# EAGLE design VC02 (EAGLE 7.3.0)
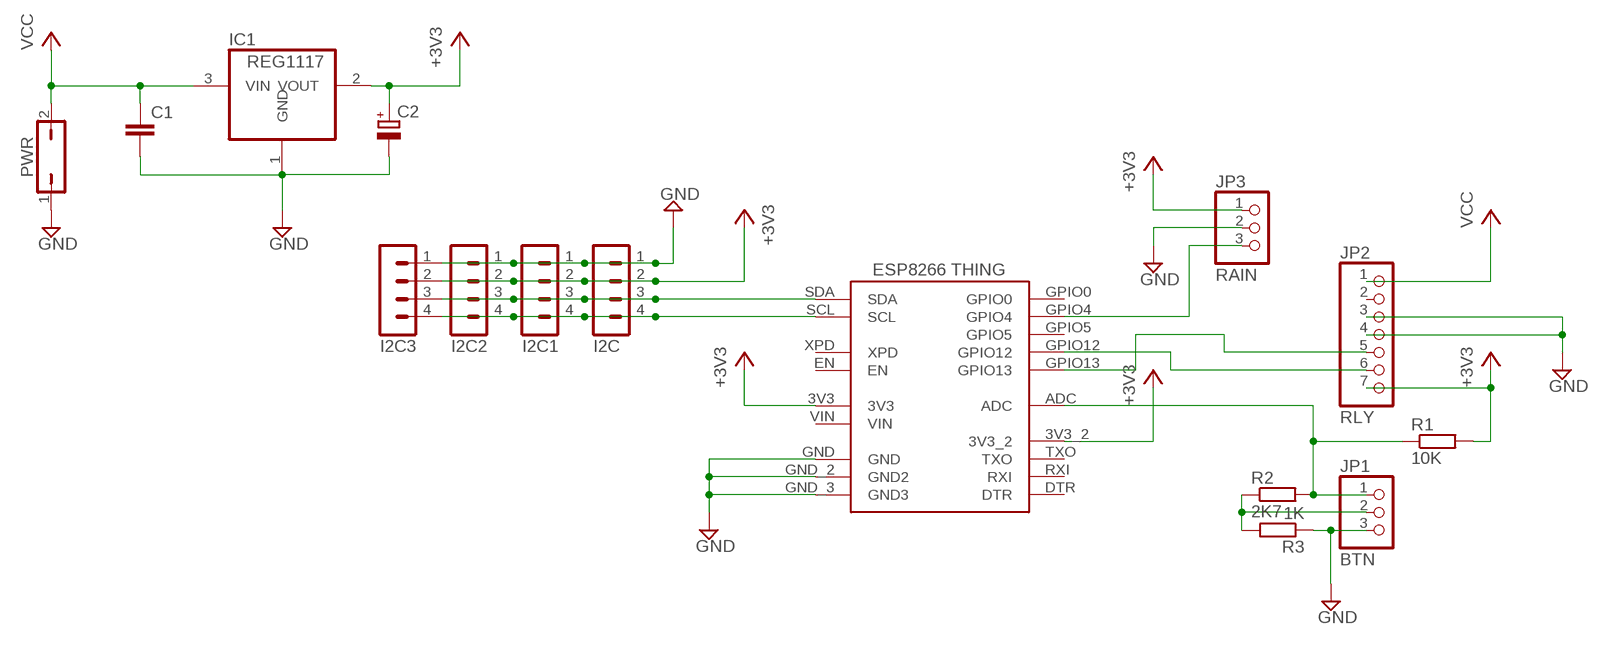
[diagram p0: schematic, sheet 1]

## Parts
C1  C-EUC0603K  [C0603K]
C2  CPOL-EUB  [PANASONIC_B]
I2C  MA04-1  [MA04-1]
I2C1  MA04-1  [MA04-1]
I2C2  MA04-1  [MA04-1]
I2C3  MA04-1  [MA04-1]
IC1  REG1117  [SOT223]
JP1  BTN  PINHD-1X3  [1X03]
JP2  RLY  PINHD-1X7  [1X07]
JP3  RAIN  PINHD-1X3  [1X03]
PWR  JP1Q  [JP1]
R1  10K  R-EU_R0805  [R0805]
R2  2K7  R-EU_R0805  [R0805]
R3  1K  R-EU_R0805  [R0805]
U$1  ESP8266_THING  [ESP8266_THING]

## Nets
+3V3: C2.+ I2C1.2 I2C2.2 I2C3.2 I2C.2 IC1.2(VOUT) JP2.7 JP3.1 R1.2 U$1.3V3 U$1.3V3_2
GND: C1.2 C2.- I2C1.1 I2C2.1 I2C3.1 I2C.1 IC1.1(GND) JP1.3 JP2.3 JP2.4 JP3.2 PWR.1 R3.1 U$1.GND U$1.GND_2(GND2) U$1.GND_3(GND3)
N$1: JP2.6 U$1.GPIO12
N$2: JP2.5 U$1.GPIO13
N$3: JP3.3 U$1.GPIO4
N$6: JP1.2 R2.1 R3.2
N$7: JP1.1 R1.1 R2.2 U$1.ADC
N$10: I2C1.4 I2C2.4 I2C3.4 I2C.4 U$1.SCL
N$11: I2C1.3 I2C2.3 I2C3.3 I2C.3 U$1.SDA
VCC: C1.1 IC1.3(VIN) JP2.1 PWR.2
Unconnected: JP2.2 U$1.DTR U$1.EN U$1.GPIO0 U$1.GPIO5 U$1.RXI U$1.TXO U$1.XPD

## Power pins joined to a net without a drawn wire
VIN: U$1.VIN

## Library data of the parts
C1 = rcl:C-EU: CAPACITOR, European symbol; MF: AVX; MPN: 0603YC104K4T2A; OC_FARNELL: 2332664
C2 = rcl:CPOL-EU: POLARIZED CAPACITOR, European symbol; MF: PANASONIC ELECTRONIC COMPONENTS; MPN: EEEFC1C220AR; OC_FARNELL: 1244351
I2C I2C1-I2C3 = con-lstb:MA04-1: PIN HEADER; OC_FARNELL: unknown; OC_NEWARK: unknown
IC1 = burr-brown:REG1117: 800mA and 1A Low Dropout (LDO) Positive Regulator 1.8V, 2.5V, 2.85V, 3.3V, 5V, and Adj; MF: STMICROELECTRONICS; MPN: LD1117S33TR; OC_FARNELL: 1202826; OC_NEWARK: 14P6981
JP1 JP3 = pinhead:PINHD-1X3: PIN HEADER; OC_FARNELL: unknown
JP2 = pinhead:PINHD-1X7: PIN HEADER; OC_FARNELL: unknown
PWR = jumper:JP1Q: JUMPER; MF: TE CONNECTIVITY / AMP; MPN: 640452-2; OC_FARNELL: 588398
R1 = resistor:R-EU_: RESISTOR, European symbol; MF: VISHAY DRALORIC; MPN: CRCW080510K0FKEA; OC_FARNELL: 1469856
R2 = resistor:R-EU_: RESISTOR, European symbol; MF: VISHAY DRALORIC; MPN: CRCW08052K70FKEA; OC_FARNELL: 1469891
R3 = resistor:R-EU_: RESISTOR, European symbol; MF: VISHAY DRALORIC; MPN: CRCW08051K00FKEA; OC_FARNELL: 1469847
U$1 = Steves-Devices:ESP8266_THING: SparkFun ESP8266 Thing; OC_FARNELL: unknown

## Net classes
0 default: width 0.813 mm, drill 0.61 mm, clearance 0.508 mm

## Board
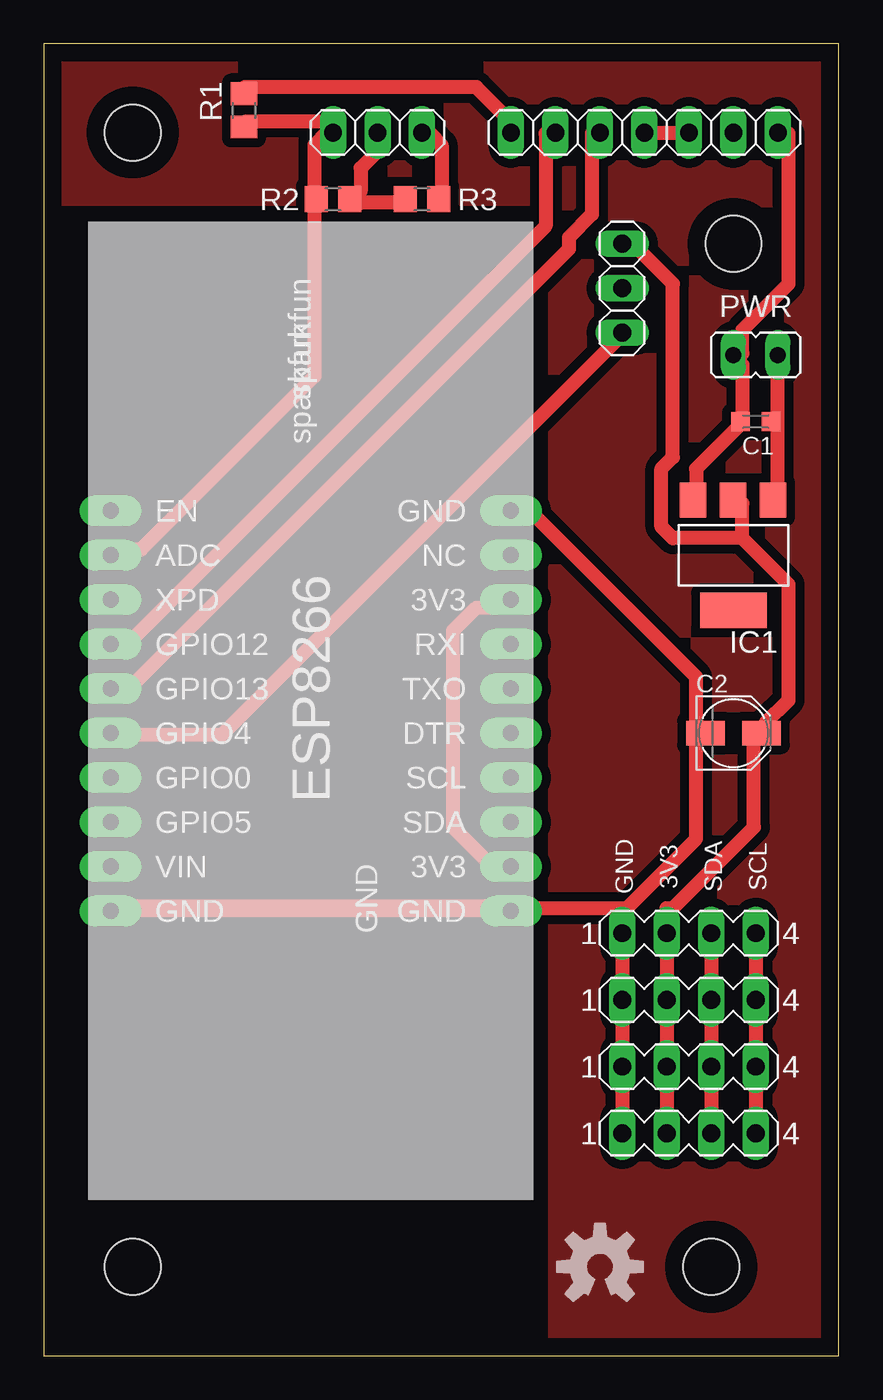
[diagram p1: board, top side]
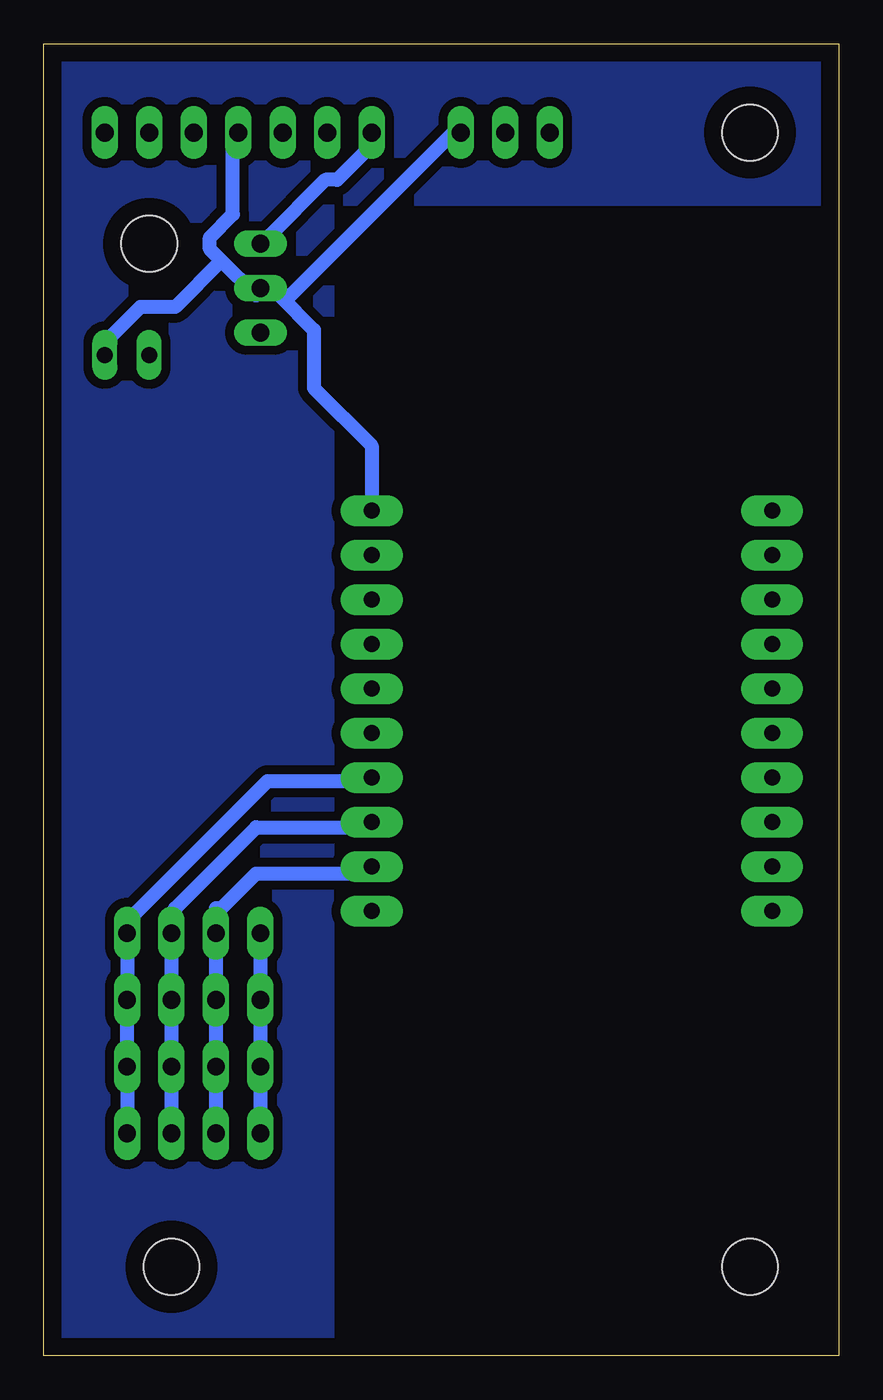
[diagram p2: board, bottom side, seen from below]

Size 45.39 x 74.92 mm. Coordinates in mm from the lower left corner, seen from the top.
Outline: 0,0 45.39,0 45.39,74.92 0,74.92 0,0
Copper layers (1*16): Top 0.035mm / dielectric 1.5mm / Bottom 0.035mm
Design rules "default": minimum track width 10mil, minimum drill 24mil, track to track 8mil, track to pad 8mil, pad to pad 8mil, via to via 8mil, smd to smd 8mil, copper to edge 40mil, drill to drill 8mil, minimum pad ring 10mil, minimum via ring 8mil, stop-mask expansion 4mil, vias tented up to drill 0mil, thermal gap 10mil
Holes 3.2 mm at 5.08,69.85 5.08,5.08 39.37,63.5 38.1,5.08

### Footprints (pad centres in the part's own frame; a part is rotated, then mirrored left to right if it is on the bottom)
C0603K = smd 1.05 x 1.08: 1 -0.875,0; 2 0.875,0
PANASONIC_B = smd 2.2 x 1.4: + 1.6,0; - -1.6,0
MA04-1 = drill 1.016 long: 1 -3.81,0; 2 -1.27,0; 3 1.27,0; 4 3.81,0
SOT223 = smd 1.499 x 2.007: 1 -2.261,-3.15; 2 0.025,-3.15; 3 2.311,-3.15 | smd 3.81 x 2.007: 4 0,3.15
1X03 = drill 1.016 long: 1 -2.54,0; 2 0,0; 3 2.54,0
1X07 = drill 1.016 long: 1 -7.62,0; 2 -5.08,0; 3 -2.54,0; 4 0,0; 5 2.54,0; 6 5.08,0; 7 7.62,0
JP1 = drill 0.914 long: 1 0,-1.27; 2 0,1.27
R0805 = smd 1.3 x 1.5: 1 -0.95,0; 2 0.95,0
ESP8266_THING = drill 0.914 pad 1.778 long: 3V3 -7.62,-12.7; 3V3_2 7.62,-12.7; ADC 10.16,10.16; DTR 0,-12.7; EN 12.7,10.16; GND -10.16,-12.7; GND_2 12.7,-12.7; GND_3 -10.16,10.16; GPIO0 -2.54,10.16; GPIO4 0,10.16; GPIO5 -5.08,10.16; GPIO12 5.08,10.16; GPIO13 2.54,10.16; NC 10.16,-12.7; RXI 5.08,-12.7; SCL -2.54,-12.7; SDA -5.08,-12.7; TXO 2.54,-12.7; VIN -7.62,10.16; XPD 7.62,10.16

### Placement (x,y rotation side)
C1  40.64,53.34 0 top
C2  39.37,35.56 0 top
I2C  36.83,24.13 0 top
I2C1  36.83,20.32 0 top
I2C2  36.83,16.51 0 top
I2C3  36.83,12.7 0 top
IC1  39.37,45.72 180 top
JP1  19.05,69.85 0 top
JP2  34.29,69.85 180 top
JP3  33.02,60.96 270 top
PWR  40.64,57.15 90 top
R1  11.43,71.12 90 top
R2  16.51,66.04 180 top
R3  21.59,66.04 180 top
U$1  13.97,35.56 90 top
U$2  [OSHW-LOGO-M]  31.75,5.08 0 top

### Tracks (layer width: path | path; a pad name or v marks a point on that pad's centre or on a via)
+3V3
  Top 0.813: R1.2 11.48,72.44 24.69,72.44 26.67,70.46 JP2.7 | 39.88,46.68 39.88,48.67 IC1.2 | 39.88,46.68 42.52,44.04 42.52,37.44 41.2,36.12 C2.+ 40.54,35.46 40.54,30.17 35.92,25.55 35.56,25.55 I2C3.2 | 39.88,46.68 35.92,46.68 35.25,47.35 35.25,50.65 35.92,51.31 35.92,61.21 33.93,63.2 33.27,63.2 JP3.1 | U$1.3V3_2 26.67,42.72 24.69,42.72 23.37,41.4 23.37,30.17 25.35,28.19 26.67,28.19 U$1.3V3
  Bottom 0.813: JP2.7 26.67,69.14 28.65,67.16 29.31,67.16 32.61,63.86 JP3.1 | U$1.3V3 26.67,27.53 33.27,27.53 35.25,25.55 35.56,25.55 I2C.2 I2C1.2 I2C2.2 I2C3.2
GND
  Top 0.813: 41.86,53.29 41.86,56.59 PWR.1 | 41.86,53.29 41.86,49.33 IC1.1 | 41.86,53.29 C1.2 | R3.1 22.71,66.5 22.71,69.14 22.05,69.8 JP1.3 | JP2.4 34.59,69.8 36.58,69.8 JP2.3 | 4.22,25.55 U$1.GND_3 | 33.02,25.55 26.67,25.55 U$1.GND | 33.02,25.55 33.27,25.55 37.24,29.52 37.24,35.46 C2.- 37.24,36.12 37.24,38.76 27.99,48.01 27.33,48.01 | 33.02,25.55 I2C.1 I2C3.1 | 27.33,48.01 26.67,48.01 U$1.GND_2 27.33,48.01
  Top 1.016: 26.67,25.55 4.22,25.55
  Bottom 0.813: U$1.GND_2 26.67,51.97 29.97,55.27 29.97,58.57 31.95,60.55 | 31.95,60.55 32.61,61.21 JP3.2 | 35.25,62.53 33.27,60.55 JP3.2 | 35.25,62.53 35.92,63.2 35.92,63.86 34.59,65.18 34.59,69.8 JP2.4 | 31.95,60.55 31.29,60.55 22.05,69.8 JP1.3 | 31.95,60.55 JP3.2 | 35.25,62.53 37.9,59.89 39.88,59.89 41.86,57.91 41.86,57.25 PWR.1 | I2C.1 I2C1.1 I2C2.1 I2C3.1
N$1
  Top 0.813: JP2.6 28.65,69.8 28.65,64.52 4.88,40.74 4.22,40.74 U$1.GPIO12
N$2
  Top 0.813: JP2.5 31.29,69.8 31.29,65.18 29.97,63.86 29.97,63.2 4.88,38.1 U$1.GPIO13
N$3
  Top 0.813: U$1.GPIO4 4.22,35.46 10.16,35.46 32.61,57.91 JP3.3
N$6
  Top 0.813: R3.2 20.07,65.84 18.09,65.84 R2.1 18.09,66.5 18.09,67.82 19.41,69.14 19.41,69.8 JP1.2
N$7
  Top 0.813: R1.1 11.48,70.46 16.1,70.46 JP1.1 16.1,69.8 15.44,69.14 15.44,66.5 R2.2 15.44,65.84 15.44,55.93 5.54,46.02 4.22,46.02 U$1.ADC
N$8
  pour Bottom: 0,74.93 0,66.04 29.21,66.04 29.21,0 45.72,0 45.72,74.93
N$9
  pour Top: 0,74.93 45.72,74.93 45.72,0 29.21,0 29.21,66.04 0,66.04
N$10
  Top 0.813: I2C.4 I2C3.4
  Bottom 0.813: U$1.SCL 26.67,32.82 32.61,32.82 40.56,24.87 40.56,24.13 I2C.4 I2C1.4 I2C2.4 I2C3.4
N$11
  Top 0.813: I2C.3 I2C3.3
  Bottom 0.813: U$1.SDA 26.67,30.17 33.27,30.17 37.9,25.55 37.9,24.23 I2C.3 I2C1.3 I2C2.3 I2C3.3
VCC
  Top 0.813: 39.88,53.29 39.88,56.59 PWR.2 39.88,57.25 39.88,58.57 42.52,61.21 42.52,69.8 JP2.1 | 39.88,53.29 37.24,50.65 37.24,49.33 IC1.3 | 39.88,53.29 C1.1

### Text on the board
tPlace: GND | 3V3 | SDA | SCL
tValues: + | + | Steve Morgan 2015 / Rev 01